# EAGLE design tick-mini-shield-mk-1.0 (EAGLE 6.5.0)
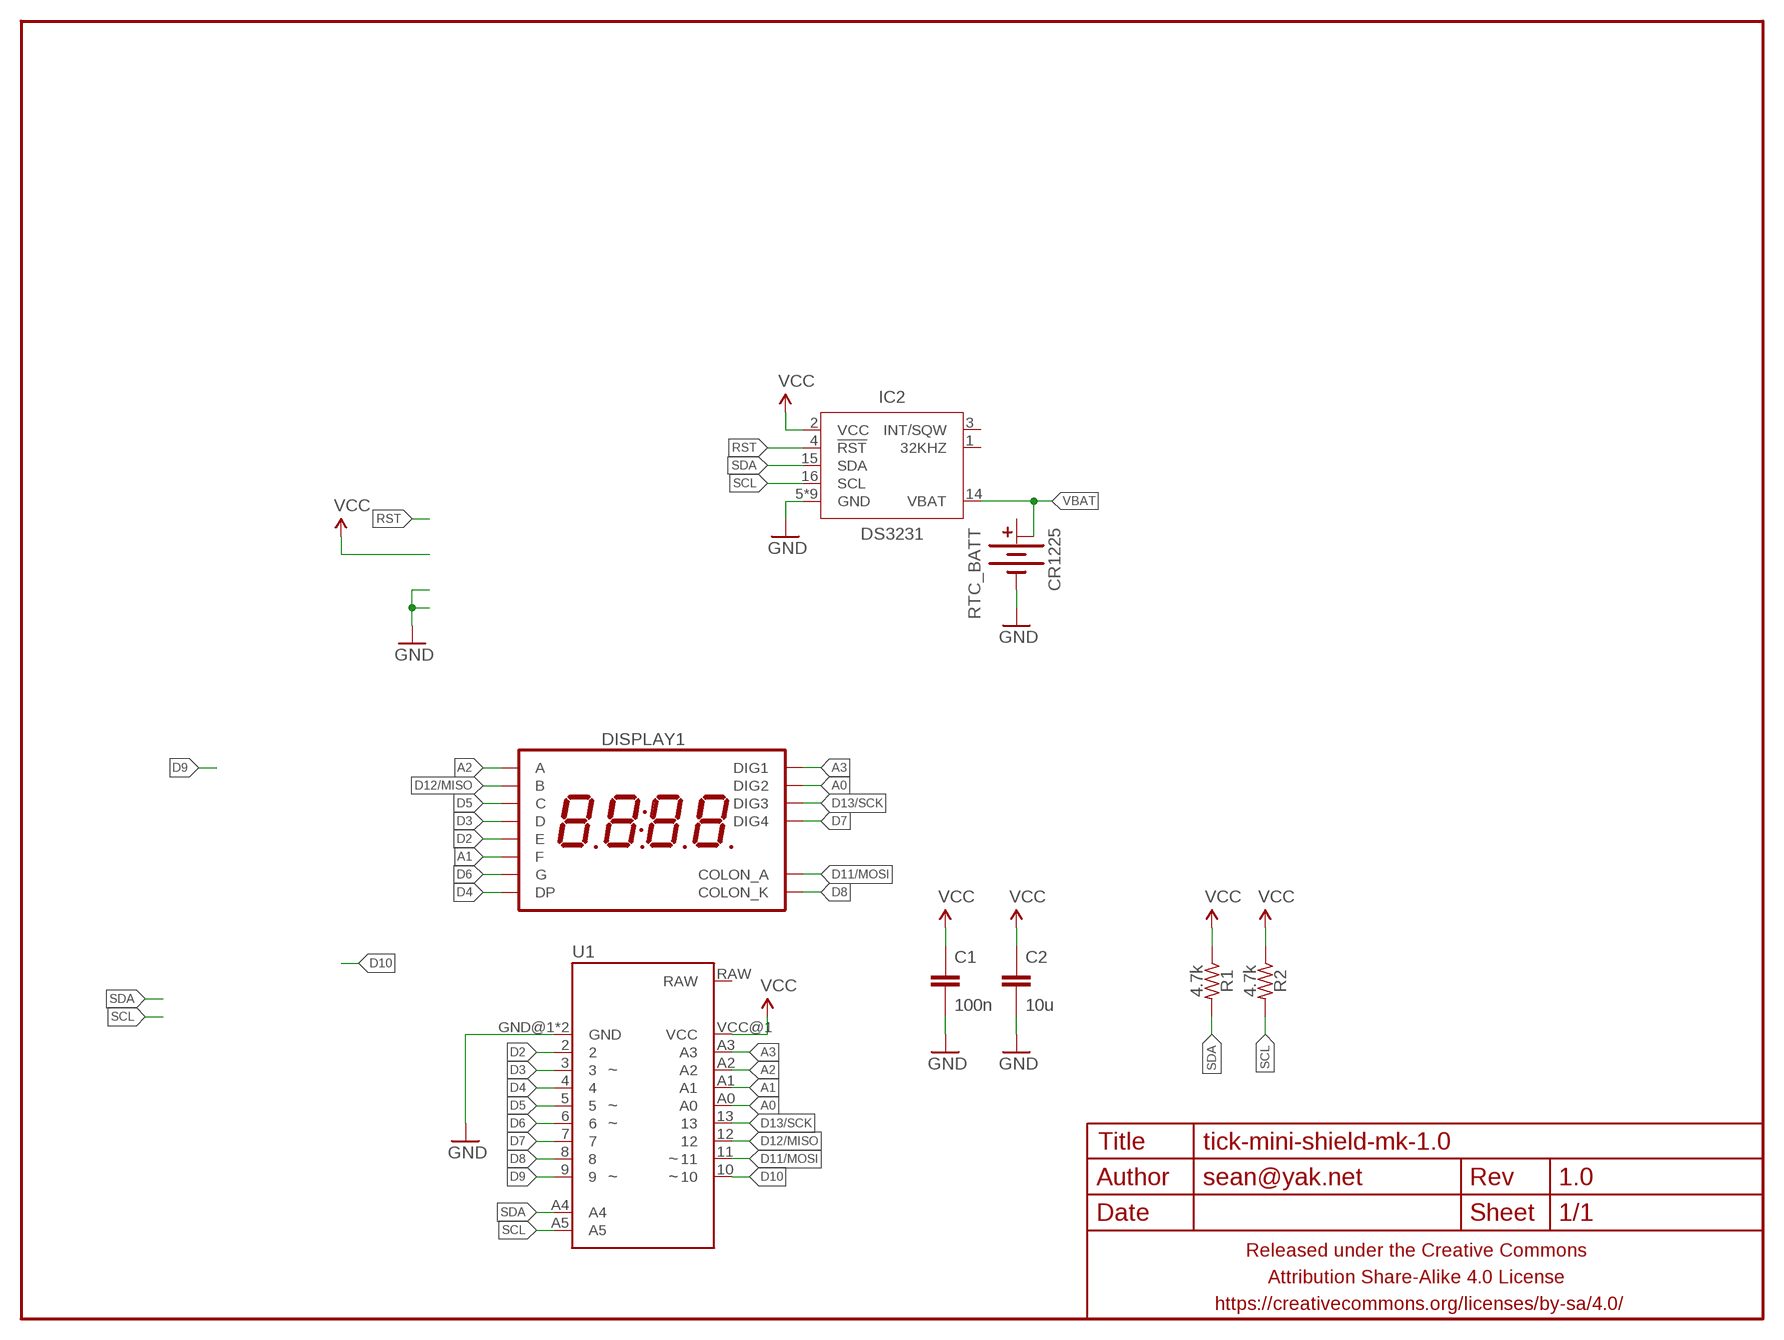
[diagram p0: schematic, sheet 1]

## Parts
C1  100n  CAPACITOR-CERAMIC025-024X044  [C025-024X044]
C2  10u  CAPACITOR-CERAMIC050-025X075  [C050-025X075]
DISPLAY1  7SEG_4DIGIT_COLONTICK  [7SEG_4DIG_TICK]
FRAME1  FRAME-LETTERNO_PACKAGE  [DUMMY]
IC2  DS3231  [SO16W]
R1  4.7k  RESISTORPTH-AXIAL-7.62MM  [RESISTOR-AXIAL-PTH-7.62MM]
R2  4.7k  RESISTORPTH-AXIAL-7.62MM  [RESISTOR-AXIAL-PTH-7.62MM]
RTC_BATT  CR1225  BATTERY-COINCR1225_PTH3  [BATTCON_12MM_PTH3]
U1  ARDUINO_PRO_MINI_TICK2  [ARDUINO_PRO_MINI_TICK2]

## Nets
A0: DISPLAY1.P$11(DIG2) U1.A0
A1: DISPLAY1.P$12(F) U1.A1
A2: DISPLAY1.P$13(A) U1.A2
A3: DISPLAY1.P$14(DIG1) U1.A3
D2: DISPLAY1.P$1(E) U1.2
D3: DISPLAY1.P$2(D) U1.3
D4: DISPLAY1.P$3(DP) U1.4
D5: DISPLAY1.P$4(C) U1.5
D6: DISPLAY1.P$5(G) U1.6
D7: DISPLAY1.P$6(DIG4) U1.7
D8: DISPLAY1.P$7(COLON_K) U1.8
D9: U1.9
D10: U1.10
D11/MOSI: DISPLAY1.P$8(COLON_A) U1.11
D12/MISO: DISPLAY1.P$9(B) U1.12
D13/SCK: DISPLAY1.P$10(DIG3) U1.13
GND: C1.2 C2.2 IC2.5(GND) IC2.6(GND) IC2.7(GND) IC2.8(GND) IC2.9(GND) IC2.10(GND) IC2.11(GND) IC2.12(GND) IC2.13(GND) RTC_BATT.- U1.GND@1(GND) U1.GND@2(GND)
RST: IC2.4(!RST)
SCL: IC2.16(SCL) R2.P$2 U1.A5
SDA: IC2.15(SDA) R1.P$2 U1.A4
VBAT: IC2.14(VBAT) RTC_BATT.+@3(+1) RTC_BATT.+@4(+1)
VCC: C1.1 C2.1 IC2.2(VCC) R1.P$1 R2.P$1 U1.VCC@1(VCC)
Unconnected: IC2.1(32KHZ) IC2.3(INT/SQW) RTC_BATT.+@1(+) RTC_BATT.+@2(+) U1.RAW

## Library data of the parts
C1 C2 = A_butts:CAPACITOR-CERAMIC: CAPACITOR, European symbol
DISPLAY1 = A_butts:7SEG_4DIGIT_COLON
FRAME1 = A_butts:FRAME-LETTER: Schematic Frame Standard 8.5x11 US Letter frame; DESIGNER: sean@yak.net; VERSION: 1.0
IC2 = A_butts:DS3231
R1 R2 = A_butts:RESISTOR: RESISTOR, American symbol
RTC_BATT = A_butts:BATTERY-COIN
U1 = A_butts:ARDUINO_PRO_MINI_TICK2

## Board
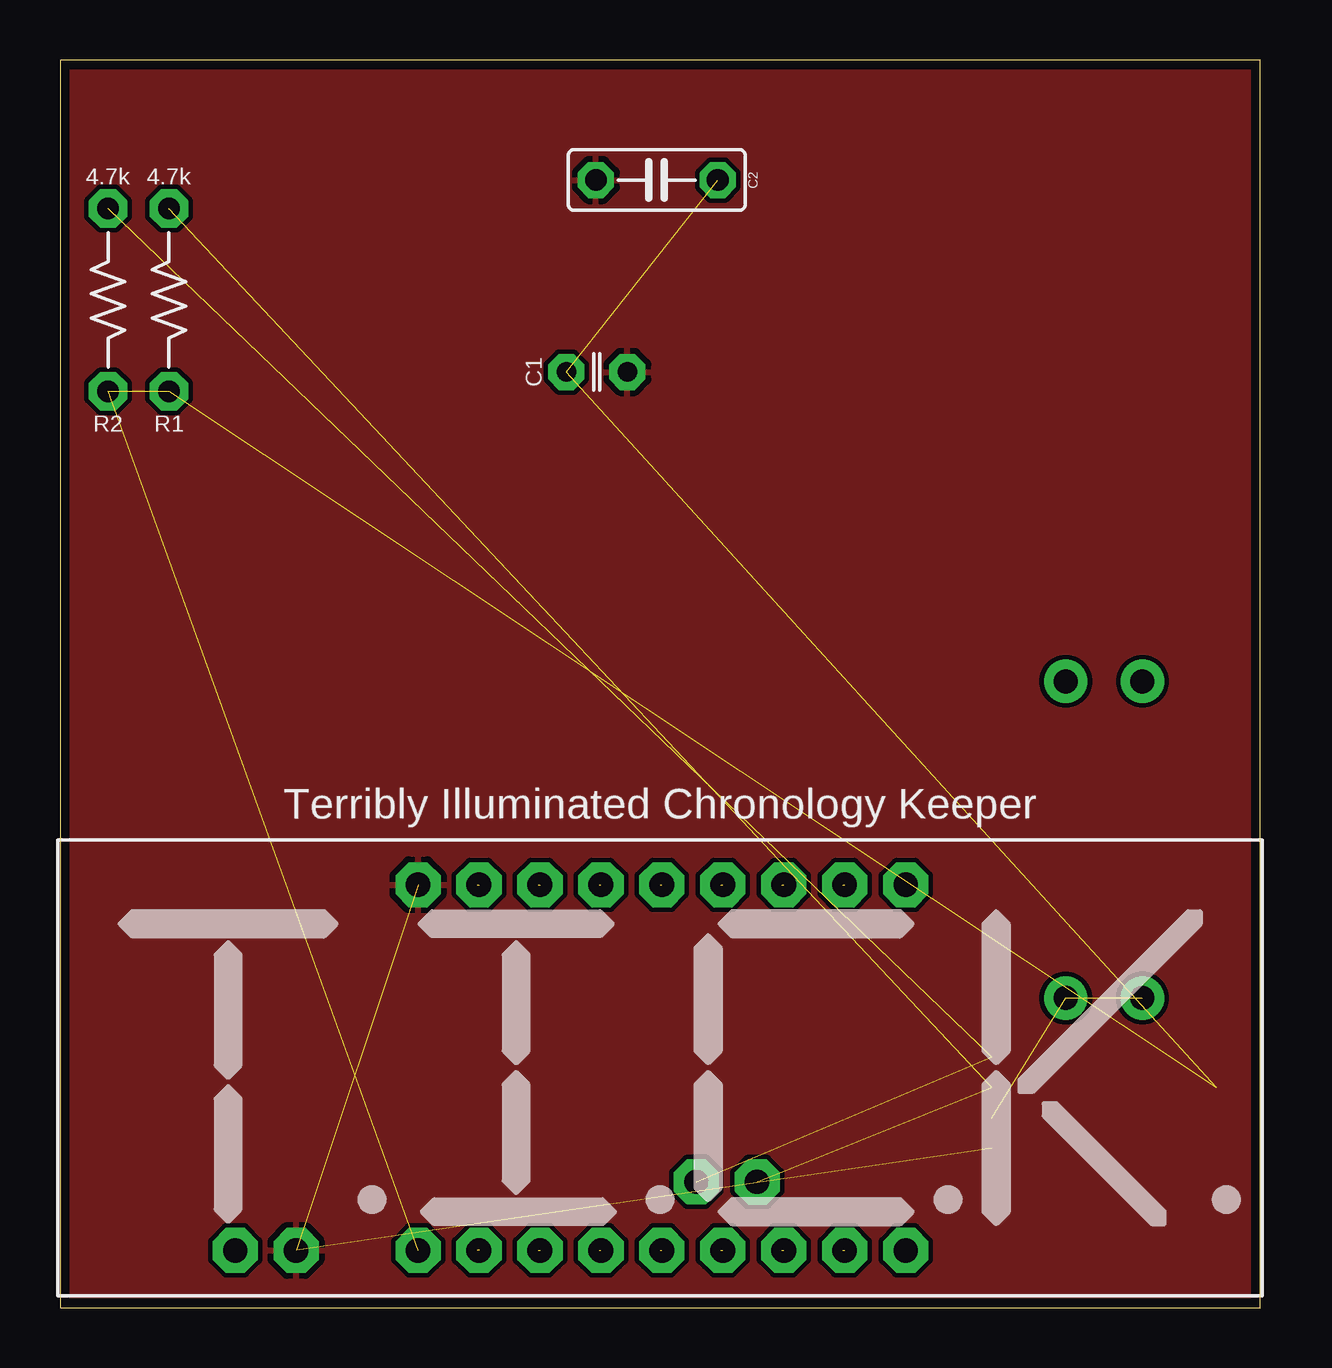
[diagram p1: board, top side]
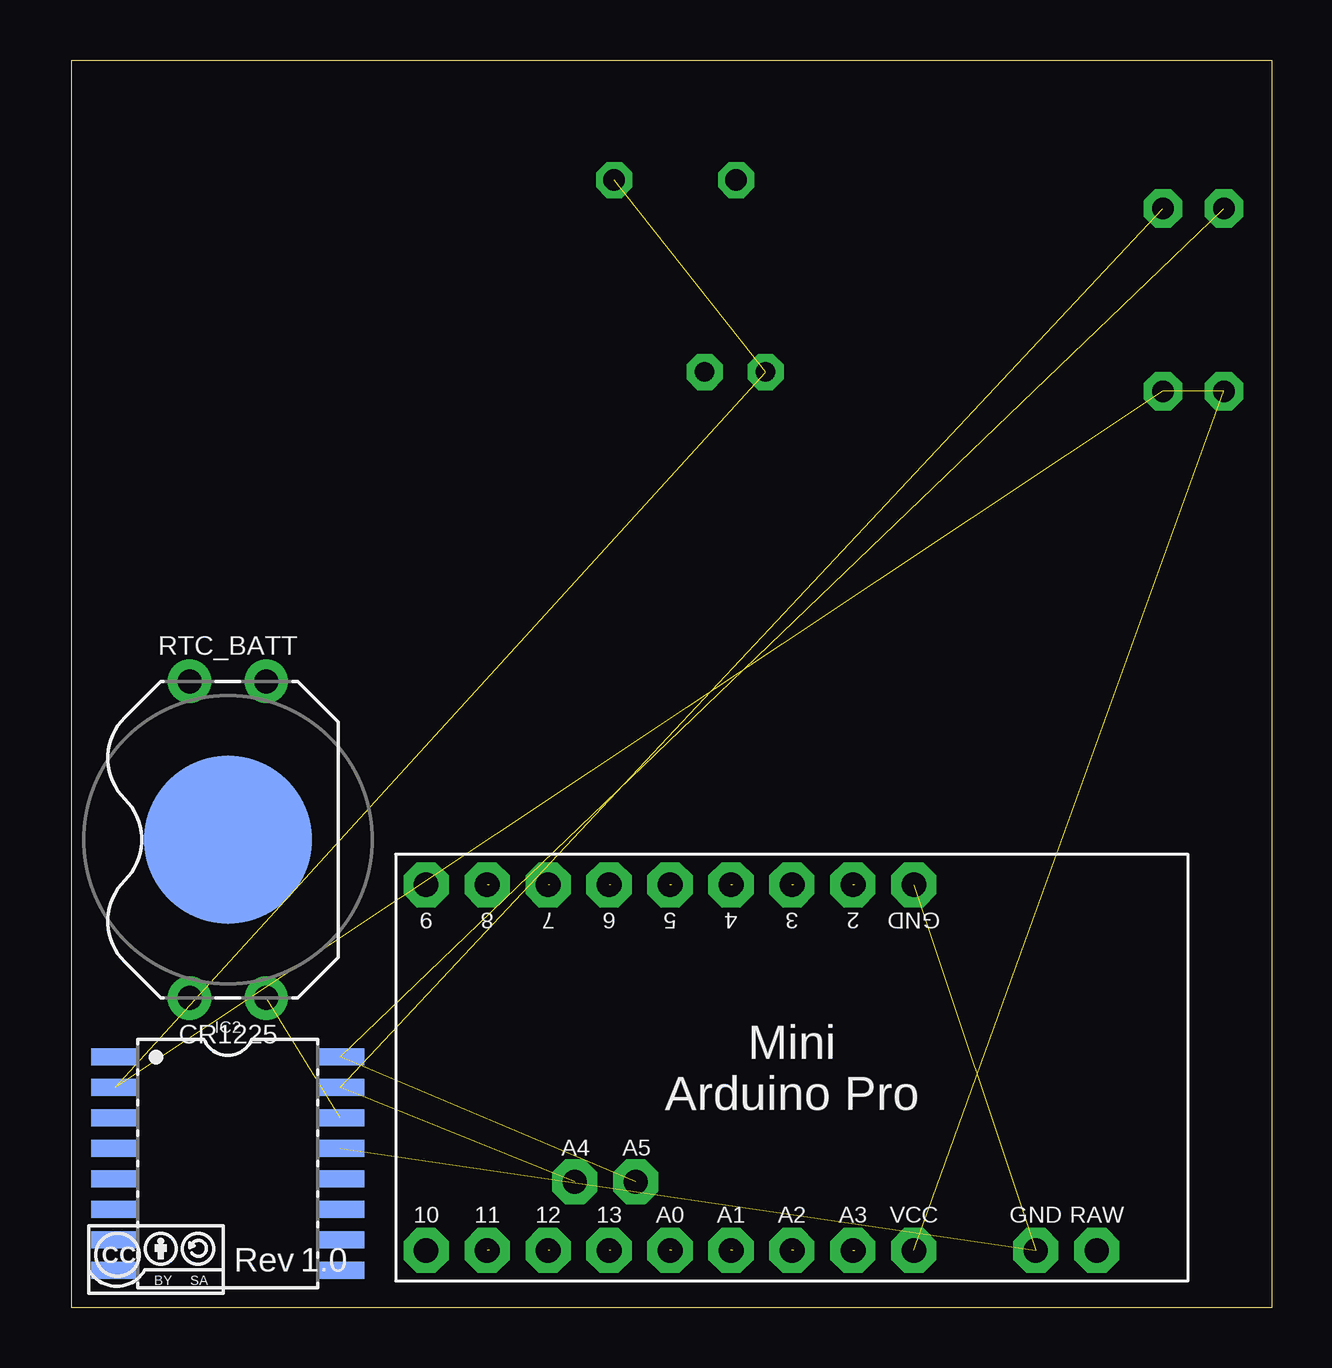
[diagram p2: board, bottom side, seen from below]

Size 50 x 52 mm. Coordinates in mm from the lower left corner, seen from the top.
Outline: 50,52 0,52 0,0 50,0 50,52
Copper layers (1*16): Top 0.0356mm / dielectric 1.5011mm / Bottom 0.0356mm
Design rules "LaenPCBOrder_2": minimum track width 6mil, minimum drill 13mil, track to track 6mil, track to pad 6mil, pad to pad 6mil, via to via 6mil, smd to smd 6mil, copper to edge 15mil, drill to drill 6mil, minimum pad ring 7mil, minimum via ring 7mil, stop-mask expansion 3mil, vias tented up to drill 20mil, thermal gap 10mil

### Footprints (pad centres in the part's own frame; a part is rotated, then mirrored left to right if it is on the bottom)
C025-024X044 = drill 0.813 pad 1.5 octagon: 1 -1.27,0; 2 1.27,0
C050-025X075 = drill 0.9 pad 1.5 octagon: 1 -2.54,0; 2 2.54,0
7SEG_4DIG_TICK = drill 0.9 pad 1.5 octagon: P$1 -7.62,7.62; P$2 -5.08,7.62; P$3 -2.54,7.62; P$4 0,7.62; P$5 2.54,7.62; P$6 5.08,7.62; P$7 7.62,7.62; P$8 7.62,-7.62; P$9 5.08,-7.62; P$10 2.54,-7.62; P$11 0,-7.62; P$12 -2.54,-7.62; P$13 -5.08,-7.62; P$14 -7.62,-7.62
SO16W = smd 0.7 x 2: 1 -4.445,-4.685; 2 -3.175,-4.685; 3 -1.905,-4.685; 4 -0.635,-4.685; 5 0.635,-4.685; 6 1.905,-4.685; 7 3.175,-4.685; 8 4.445,-4.685; 9 4.445,4.685; 10 3.175,4.685; 11 1.905,4.685; 12 0.635,4.685; 13 -0.635,4.685; 14 -1.905,4.685; 15 -3.175,4.685; 16 -4.445,4.685
RESISTOR-AXIAL-PTH-7.62MM = drill 0.9 pad 1.6 octagon: P$1 -3.81,0; P$2 3.81,0
BATTCON_12MM_PTH3 = drill 1 pad 1.8: +@1 -6.6,1.6; +@2 -6.6,-1.6; +@3 6.6,-1.6; +@4 6.6,1.6 | smd 7 x 7: - 0,0
ARDUINO_PRO_MINI_TICK2 = drill 1.016 pad 1.88 octagon: 2 -7.62,2.54; 3 -7.62,0; 4 -7.62,-2.54; 5 -7.62,-5.08; 6 -7.62,-7.62; 7 -7.62,-10.16; 8 -7.62,-12.7; 9 -7.62,-15.24; 10 7.62,-15.24; 11 7.62,-12.7; 12 7.62,-10.16; 13 7.62,-7.62; A0 7.62,-5.08; A1 7.62,-2.54; A2 7.62,0; A3 7.62,2.54; A4 4.763,-9.049; A5 4.763,-6.509; GND@1 -7.62,5.08; GND@2 7.62,10.16; RAW 7.62,12.7; VCC@1 7.62,5.08

### Placement (x,y rotation side)
C1  22.37,39 0 top
C2  24.86,47 180 top
DISPLAY1  25,10 0 top
FRAME1  0,-0.5 0 top
IC2  43.5,6 270 bottom
R1  4.54,42 90 top
R2  2,42 90 top
RTC_BATT  43.5,19.5 270 bottom
U1  20,10 270 bottom
U$4  [CC-BY-SA-4.0-NO-URL]  46.5,2 0 bottom
U$7  [OSHWLOGO_TOP_0.2_A]  57.5,42.5 0 top  (outside the outline)
U$8  [OSHWLOGO_TOP_0.2_A]  57.5,42.5 0 bottom  (outside the outline)

### Tracks (layer width: path | path; a pad name or v marks a point on that pad's centre or on a via)
A0  (1 unrouted)
A1  (1 unrouted)
A2  (1 unrouted)
A3  (1 unrouted)
D2  (1 unrouted)
D3  (1 unrouted)
D4  (1 unrouted)
D5  (1 unrouted)
D6  (1 unrouted)
D7  (1 unrouted)
D8  (1 unrouted)
D11/MOSI  (1 unrouted)
D12/MISO  (1 unrouted)
D13/SCK  (1 unrouted)
GND  (2 unrouted)
  pour Top (isolate 0.2): 50,52 50,0 0,0 0,52
SCL  (2 unrouted)
SDA  (2 unrouted)
VBAT  (2 unrouted)
VCC  (5 unrouted)

### Text on the board
tPlace: Terribly Illuminated Chronology Keeper
bPlace: Rev